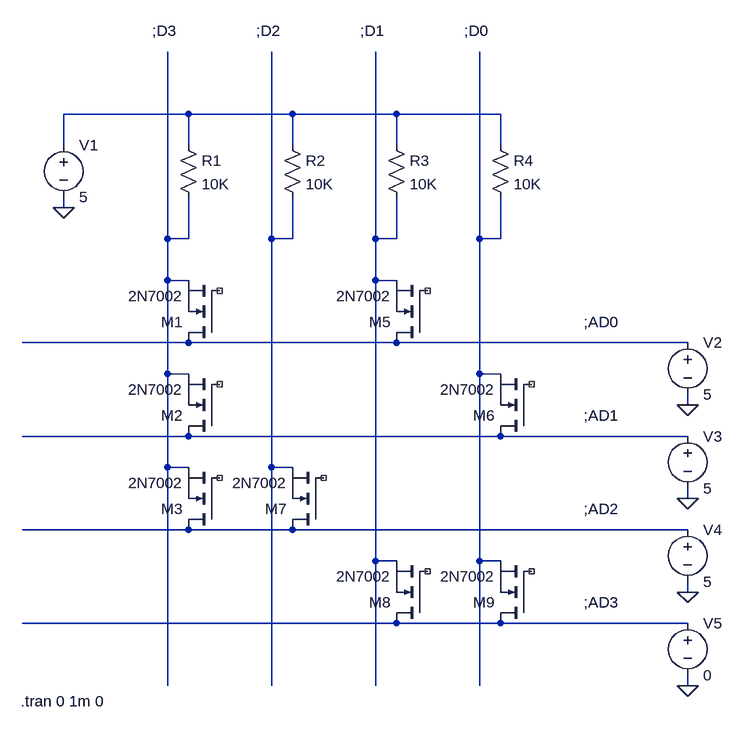
[diagram p0: schematic ROM_Array.asc]
ROM_Array.asc, the LTspice schematic file:
Version 4
SHEET 1 984 680
WIRE -112 -352 -304 -352
WIRE 48 -352 -112 -352
WIRE 208 -352 48 -352
WIRE 368 -352 208 -352
WIRE -304 -304 -304 -352
WIRE -112 -304 -112 -352
WIRE 48 -304 48 -352
WIRE 208 -304 208 -352
WIRE 368 -304 368 -352
WIRE -304 -208 -304 -224
WIRE -144 -160 -144 -448
WIRE -112 -160 -112 -224
WIRE -112 -160 -144 -160
WIRE 16 -160 16 -448
WIRE 48 -160 48 -224
WIRE 48 -160 16 -160
WIRE 176 -160 176 -448
WIRE 208 -160 208 -224
WIRE 208 -160 176 -160
WIRE 336 -160 336 -448
WIRE 368 -160 368 -224
WIRE 368 -160 336 -160
WIRE -144 -96 -144 -160
WIRE -112 -96 -144 -96
WIRE 176 -96 176 -160
WIRE 208 -96 176 -96
WIRE -112 0 -368 0
WIRE 208 0 -112 0
WIRE 656 0 208 0
WIRE -144 48 -144 -96
WIRE -112 48 -144 48
WIRE 336 48 336 -160
WIRE 368 48 336 48
WIRE 656 96 656 80
WIRE -112 144 -368 144
WIRE 368 144 -112 144
WIRE 656 144 368 144
WIRE -144 192 -144 48
WIRE -112 192 -144 192
WIRE 16 192 16 -160
WIRE 48 192 16 192
WIRE 656 240 656 224
WIRE -112 288 -368 288
WIRE 48 288 -112 288
WIRE 656 288 48 288
WIRE 176 336 176 -96
WIRE 208 336 176 336
WIRE 336 336 336 48
WIRE 368 336 336 336
WIRE 656 384 656 368
WIRE 208 432 -368 432
WIRE 368 432 208 432
WIRE 656 432 368 432
WIRE -144 528 -144 192
WIRE 16 528 16 192
WIRE 176 528 176 336
WIRE 336 528 336 336
WIRE 656 528 656 512
FLAG -304 -208 0
FLAG 656 96 0
FLAG 656 240 0
FLAG 656 384 0
FLAG 656 528 0
SYMBOL nmos -64 0 R180
SYMATTR InstName M1
SYMATTR Value 2N7002
SYMBOL voltage -304 -320 R0
WINDOW 123 0 0 Left 0
WINDOW 39 0 0 Left 0
SYMATTR InstName V1
SYMATTR Value 5
SYMBOL res -128 -320 R0
SYMATTR InstName R1
SYMATTR Value 10K
SYMBOL res 32 -320 R0
SYMATTR InstName R2
SYMATTR Value 10K
SYMBOL res 192 -320 R0
SYMATTR InstName R3
SYMATTR Value 10K
SYMBOL res 352 -320 R0
SYMATTR InstName R4
SYMATTR Value 10K
SYMBOL nmos -64 144 R180
SYMATTR InstName M2
SYMATTR Value 2N7002
SYMBOL nmos -64 288 R180
SYMATTR InstName M3
SYMATTR Value 2N7002
SYMBOL nmos 256 0 R180
SYMATTR InstName M5
SYMATTR Value 2N7002
SYMBOL nmos 416 144 R180
SYMATTR InstName M6
SYMATTR Value 2N7002
SYMBOL nmos 96 288 R180
SYMATTR InstName M7
SYMATTR Value 2N7002
SYMBOL voltage 656 -16 R0
WINDOW 123 0 0 Left 0
WINDOW 39 0 0 Left 0
SYMATTR InstName V2
SYMATTR Value 5
SYMBOL voltage 656 128 R0
WINDOW 123 0 0 Left 0
WINDOW 39 0 0 Left 0
SYMATTR InstName V3
SYMATTR Value 5
SYMBOL voltage 656 272 R0
WINDOW 123 0 0 Left 0
WINDOW 39 0 0 Left 0
SYMATTR InstName V4
SYMATTR Value 5
SYMBOL voltage 656 416 R0
WINDOW 123 0 0 Left 0
WINDOW 39 0 0 Left 0
SYMATTR InstName V5
SYMATTR Value 0
SYMBOL nmos 256 432 R180
SYMATTR InstName M8
SYMATTR Value 2N7002
SYMBOL nmos 416 432 R180
SYMATTR InstName M9
SYMATTR Value 2N7002
TEXT 496 -32 Left 2 !;AD0
TEXT 496 112 Left 2 !;AD1
TEXT 496 256 Left 2 !;AD2
TEXT 496 400 Left 2 !;AD3
TEXT -168 -480 Left 2 !;D3
TEXT -8 -480 Left 2 !;D2
TEXT 152 -480 Left 2 !;D1
TEXT 312 -480 Left 2 !;D0
TEXT -370 552 Left 2 !.tran 0 1m 0

The netlist it stands for:
* ROM_Array.asc
M1 N006 NC_01 N002 N002 2N7002
V1 N001 0 5
R1 N001 N002 10K
R2 N001 N003 10K
R3 N001 N004 10K
R4 N001 N005 10K
M2 N007 NC_02 N002 N002 2N7002
M3 N008 NC_03 N002 N002 2N7002
M5 N006 NC_04 N004 N004 2N7002
M6 N007 NC_05 N005 N005 2N7002
M7 N008 NC_06 N003 N003 2N7002
V2 N006 0 5
V3 N007 0 5
V4 N008 0 5
V5 N009 0 0
M8 N009 NC_07 N004 N004 2N7002
M9 N009 NC_08 N005 N005 2N7002
.model NMOS NMOS
.model PMOS PMOS
.lib standard.mos
;AD0
;AD1
;AD2
;AD3
;D3
;D2
;D1
;D0
.tran 0 1m 0
.backanno
.end